# Altium schematic sheet Accelerometer.SchDoc
size 420 x 297 mm
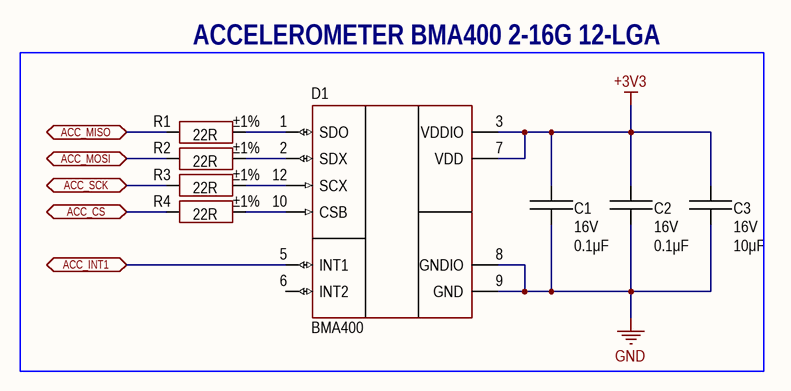
[diagram p0: Accelerometer.SchDoc]

## Parts
C1  value 0.1μF  Voltage: 16V  [CAP: 0402]
C2  value 0.1μF  Voltage: 16V  [CAP: 0402]
C3  value 10μF  Voltage: 16V  [CAP: 0805]
D1  (no value)  [12-VFLGA]
R1  value 22R  Tolerance: ±1%  [RES: 0402]
R2  value 22R  Tolerance: ±1%  [RES: 0402]
R3  value 22R  Tolerance: ±1%  [RES: 0402]
R4  value 22R  Tolerance: ±1%  [RES: 0402]

## Blocks framed on the sheet
ACCELEROMETER BMA400 2-16G 12-LGA: C1-C3 D1 R1-R4

## Ports
ACC_CS (bidir), ACC_INT1 (bidir), ACC_MISO (bidir), ACC_MOSI (bidir), ACC_SCK (bidir)

## Nets
+3V3: C1.2 C2.2 C3.2 D1.3(VDDIO) D1.7(VDD)
GND: C1.1 C2.1 C3.1 D1.8(GNDIO) D1.9(GND)
ACC_CS: R4.1 ; port ACC_CS
ACC_INT1: D1.5(INT1) ; port ACC_INT1
ACC_MISO: R1.1 ; port ACC_MISO
ACC_MOSI: R2.1 ; port ACC_MOSI
ACC_SCK: R3.1 ; port ACC_SCK
NetD1_1: D1.1(SDO) R1.2
NetD1_2: D1.2(SDX) R2.2
NetD1_10: D1.10(CSB) R4.2
NetD1_12: D1.12(SCX) R3.2

Not connected (* = marked no-connect by the designer): D1 6(INT2)

## Notes on the sheet
- Author
- Manufacturer
- Date
- Page
- Total pages
- Size page
- A3
- Materials

## Library data of the parts
C1 C2 = Ceramic_0402: ±10% 16V Ceramic Capacitor X7R 0402 (1005 Metric); Manufacturer: Yageo; PartNumber: CC0402KRX7R7BB104; ValueManufacturerPartNumber: Ceramic capacitor, 0.1μF, X7R, ±10%, 16V, 0402, -55...+125°C; Package: 0402; HelpURL: https://www.digikey.com/product-detail/en/yageo/CC0402KRX7R7BB104/311-1338-1-ND/2103122; Temperature: -55...+125°C; TypeCapacitor: Ceramic capacitor; Tolerance: ±10%; TypeDielectric: X7R
C3 = Ceramic_0805: ±20% 16V Ceramic Capacitor X7R 0805 (2012 Metric); Manufacturer: Yageo; PartNumber: CC0805MKX7R7BB106; ValueManufacturerPartNumber: Ceramic capacitor, 10μF, X7R, ±10%, 16V, 0805, -55...+125°C; Tolerance: ±10%; Package: 0805; HelpURL: https://www.digikey.com/en/products/detail/yageo/CC0805MKX7R7BB106/7164392; Temperature: -55...+125°C; TypeCapacitor: Ceramic capacitor; TypeDielectric: X7R
D1 = BMA400: Accelerometer X, Y, Z Axis ±2g, 4g, 8g, 16g - 12-LGA (2x2); Manufacturer: Bosch Sensortec; Supply: 1.72...3.6V; Sensing: Digital sensor; HelpURL: https://www.digikey.com/en/products/detail/bosch-sensortec/BMA400/8634941; Package: 12-VFLGA; ComponentType: IC accelerometer; ValueManufacturerPartNumber: =ComponentType+', '+Sensing+', '+Accuracy+', '+GainBandwidth+', '+Sensitivity+', '+Temperature+', '+Package; Temperature: -40...+85°C; PartNumber: BMA400
R1-R4 = Resistor_0402: 22 Ohms ±1% 0.063W, 1/16W Chip Resistor 0402 (1005 Metric) Moisture Resistant Thick Film; Manufacturer: Yageo; PartNumber: RC0402FR-0722RL; ValueManufacturerPartNumber: Resistor film, 22R, ±1%, 0402, 0.063W, -55...+125°C; TypeResistor: Resistor film; Package: 0402; HelpURL: https://www.digikey.com/en/products/detail/yageo/RC0402FR-0722RL/726562; Temperature: -55...+125°C; Power: 0.063W